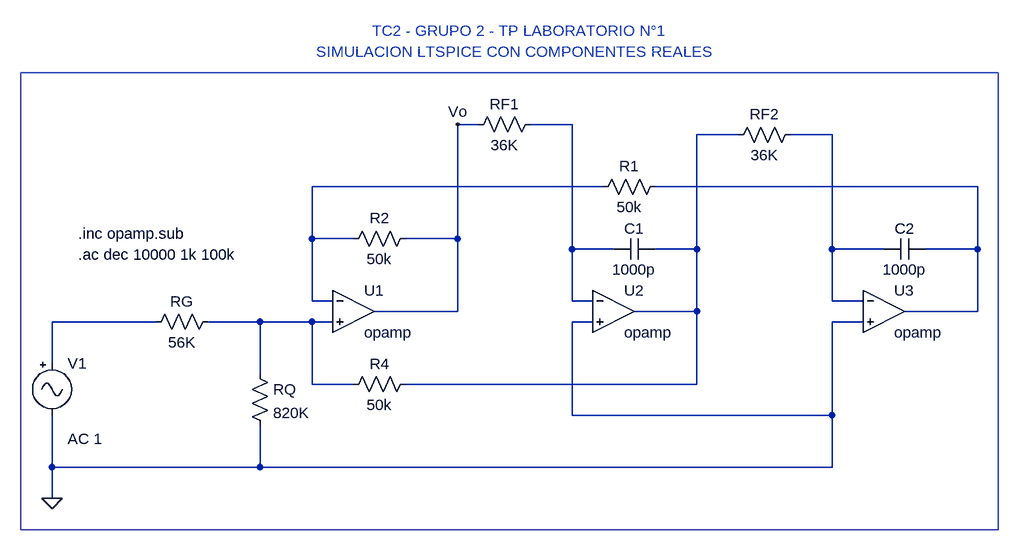
[diagram p0: schematic SimulacionLTSpiceCompReales.asc]
SimulacionLTSpiceCompReales.asc, the LTspice schematic file:
Version 4
SHEET 1 1412 680
WIRE 560 -240 528 -240
WIRE 704 -240 640 -240
WIRE 960 -224 896 -224
WIRE 1104 -224 1040 -224
WIRE 752 -144 304 -144
WIRE 1328 -144 832 -144
WIRE 304 -64 304 -144
WIRE 368 -64 304 -64
WIRE 528 -64 528 -240
WIRE 528 -64 448 -64
WIRE 704 -48 704 -240
WIRE 768 -48 704 -48
WIRE 896 -48 896 -224
WIRE 896 -48 832 -48
WIRE 1104 -48 1104 -224
WIRE 1184 -48 1104 -48
WIRE 1328 -48 1328 -144
WIRE 1328 -48 1248 -48
WIRE 304 32 304 -64
WIRE 336 32 304 32
WIRE 704 32 704 -48
WIRE 736 32 704 32
WIRE 1104 32 1104 -48
WIRE 1152 32 1104 32
WIRE 528 48 528 -64
WIRE 528 48 400 48
WIRE 896 48 896 -48
WIRE 896 48 800 48
WIRE 1328 48 1328 -48
WIRE 1328 48 1216 48
WIRE 64 64 -96 64
WIRE 224 64 144 64
WIRE 304 64 224 64
WIRE 336 64 304 64
WIRE 736 64 704 64
WIRE 1152 64 1104 64
WIRE -96 128 -96 64
WIRE 224 144 224 64
WIRE 304 160 304 64
WIRE 368 160 304 160
WIRE 896 160 896 48
WIRE 896 160 448 160
WIRE 704 208 704 64
WIRE 1104 208 1104 64
WIRE 1104 208 704 208
WIRE -96 288 -96 208
WIRE 224 288 224 224
WIRE 224 288 -96 288
WIRE 1104 288 1104 208
WIRE 1104 288 224 288
WIRE -96 336 -96 288
FLAG -96 336 0
FLAG 528 -240 Vo
SYMBOL Misc\\signal -96 112 R0
WINDOW 123 24 132 Left 2
WINDOW 39 0 0 Left 0
WINDOW 3 24 160 Left 2
SYMATTR Value2 AC 1
SYMATTR Value ""
SYMATTR InstName V1
SYMBOL res 160 48 R90
WINDOW 0 0 56 VBottom 2
WINDOW 3 32 56 VTop 2
SYMATTR InstName RG
SYMATTR Value 56K
SYMBOL res 208 128 R0
SYMATTR InstName RQ
SYMATTR Value 820K
SYMBOL OpAmps\\opamp 368 -16 R0
SYMATTR InstName U1
SYMBOL res 464 144 R90
WINDOW 0 0 56 VBottom 2
WINDOW 3 32 56 VTop 2
SYMATTR InstName R4
SYMATTR Value 50k
SYMBOL res 464 -80 R90
WINDOW 0 0 56 VBottom 2
WINDOW 3 32 56 VTop 2
SYMATTR InstName R2
SYMATTR Value 50k
SYMBOL res 656 -256 R90
WINDOW 0 0 56 VBottom 2
WINDOW 3 32 56 VTop 2
SYMATTR InstName RF1
SYMATTR Value 36K
SYMBOL res 848 -160 R90
WINDOW 0 0 56 VBottom 2
WINDOW 3 32 56 VTop 2
SYMATTR InstName R1
SYMATTR Value 50k
SYMBOL OpAmps\\opamp 768 -16 R0
SYMATTR InstName U2
SYMBOL cap 832 -64 R90
WINDOW 0 0 32 VBottom 2
WINDOW 3 32 32 VTop 2
SYMATTR InstName C1
SYMATTR Value 1000p
SYMBOL res 1056 -240 R90
WINDOW 0 0 56 VBottom 2
WINDOW 3 32 56 VTop 2
SYMATTR InstName RF2
SYMATTR Value 36K
SYMBOL OpAmps\\opamp 1184 -16 R0
SYMATTR InstName U3
SYMBOL cap 1248 -64 R90
WINDOW 0 0 32 VBottom 2
WINDOW 3 32 32 VTop 2
SYMATTR InstName C2
SYMATTR Value 1000p
TEXT -56 -40 Left 2 !.ac dec 10000 1k 100k
TEXT -56 -72 Left 2 !.inc opamp.sub
TEXT 624 -384 Center 2 ;TC2 - GRUPO 2 - TP LABORATORIO N°1
TEXT 616 -352 Center 2 ;SIMULACION LTSPICE CON COMPONENTES REALES
RECTANGLE Normal 1360 384 -144 -320

The netlist it stands for:
* SimulacionLTSpiceCompReales.asc
V1 N006 0 AC 1
RG N007 N006 56K
RQ N007 0 820K
XU1 N004 N007 Vo opamp Aol=100K GBW=10Meg  ; pins invin noninvin out
R4 N002 N007 50k
R2 Vo N004 50k
RF1 N001 Vo 36K
R1 N005 N004 50k
XU2 N001 0 N002 opamp Aol=100K GBW=10Meg  ; pins invin noninvin out
C1 N002 N001 1000p
RF2 N003 N002 36K
XU3 N003 0 N005 opamp Aol=100K GBW=10Meg  ; pins invin noninvin out
C2 N005 N003 1000p
.ac dec 10000 1k 100k
.inc opamp.sub
* TC2 - GRUPO 2 - TP LABORATORIO N°1
* SIMULACION LTSPICE CON COMPONENTES REALES
.backanno
.end